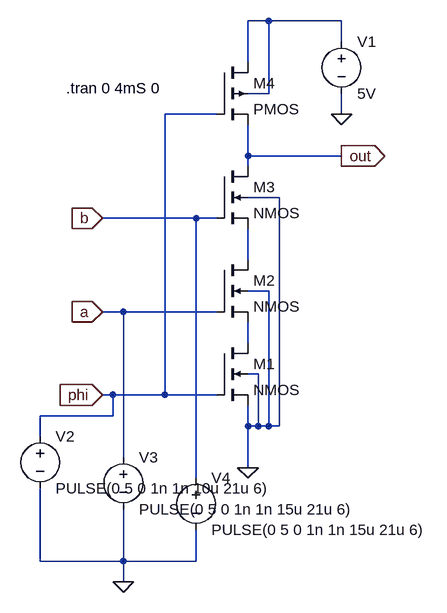
[diagram p0: schematic dynamic_NAND.asc]
dynamic_NAND.asc, the LTspice schematic file:
Version 4
SHEET 1 880 680
WIRE 224 -288 192 -288
WIRE 336 -288 224 -288
WIRE 336 -256 336 -288
WIRE 192 -224 192 -288
WIRE 224 -176 224 -288
WIRE 224 -176 192 -176
WIRE 144 -144 64 -144
WIRE 336 -144 336 -176
WIRE 192 -80 192 -128
WIRE 336 -80 192 -80
WIRE 192 -64 192 -80
WIRE 240 -16 192 -16
WIRE 112 16 -32 16
WIRE 144 16 112 16
WIRE 192 80 192 32
WIRE 224 128 192 128
WIRE 0 160 -32 160
WIRE 144 160 0 160
WIRE 192 208 192 176
WIRE 208 256 192 256
WIRE -16 288 -32 288
WIRE 64 288 64 -144
WIRE 64 288 -16 288
WIRE 144 288 64 288
WIRE -16 320 -16 288
WIRE -16 320 -128 320
WIRE 192 336 192 304
WIRE 208 336 208 256
WIRE 208 336 192 336
WIRE 224 336 224 128
WIRE 224 336 208 336
WIRE 240 336 240 -16
WIRE 240 336 224 336
WIRE -128 352 -128 320
WIRE 0 384 0 160
WIRE 192 400 192 336
WIRE 112 416 112 16
WIRE -128 544 -128 432
WIRE 0 544 0 464
WIRE 0 544 -128 544
WIRE 112 544 112 496
WIRE 112 544 0 544
WIRE 0 576 0 544
FLAG 192 400 0
FLAG -32 288 phi
IOPIN -32 288 In
FLAG -32 160 a
IOPIN -32 160 In
FLAG -32 16 b
IOPIN -32 16 In
FLAG 336 -144 0
FLAG 0 576 0
FLAG 336 -80 out
IOPIN 336 -80 Out
SYMBOL nmos4 144 208 R0
SYMATTR InstName M1
SYMBOL nmos4 144 80 R0
SYMATTR InstName M2
SYMBOL nmos4 144 -64 R0
SYMATTR InstName M3
SYMBOL pmos4 144 -224 R0
SYMATTR InstName M4
SYMBOL voltage 336 -272 R0
WINDOW 123 0 0 Left 0
WINDOW 39 0 0 Left 0
SYMATTR InstName V1
SYMATTR Value 5V
SYMBOL voltage -128 336 R0
WINDOW 123 0 0 Left 0
WINDOW 39 0 0 Left 0
SYMATTR InstName V2
SYMATTR Value PULSE(0 5 0 1n 1n 10u 21u 6)
SYMBOL voltage 0 368 R0
WINDOW 123 0 0 Left 0
WINDOW 39 0 0 Left 0
SYMATTR InstName V3
SYMATTR Value PULSE(0 5 0 1n 1n 15u 21u 6)
SYMBOL voltage 112 400 R0
WINDOW 123 0 0 Left 0
WINDOW 39 0 0 Left 0
SYMATTR InstName V4
SYMATTR Value PULSE(0 5 0 1n 1n 15u 21u 6)
TEXT -88 -184 Left 2 !.tran 0 4mS 0

The netlist it stands for:
* dynamic_NAND.asc
M1 N003 phi 0 0 NMOS
M2 N002 a N003 0 NMOS
M3 out b N002 0 NMOS
M4 N001 phi out N001 PMOS
V1 N001 0 5V
V2 phi 0 PULSE(0 5 0 1n 1n 10u 21u 6)
V3 a 0 PULSE(0 5 0 1n 1n 15u 21u 6)
V4 b 0 PULSE(0 5 0 1n 1n 15u 21u 6)
.model NMOS NMOS
.model PMOS PMOS
.lib standard.mos
.tran 0 4mS 0
.backanno
.end